# Altium project usbTosata_V1.1.PrjPCB
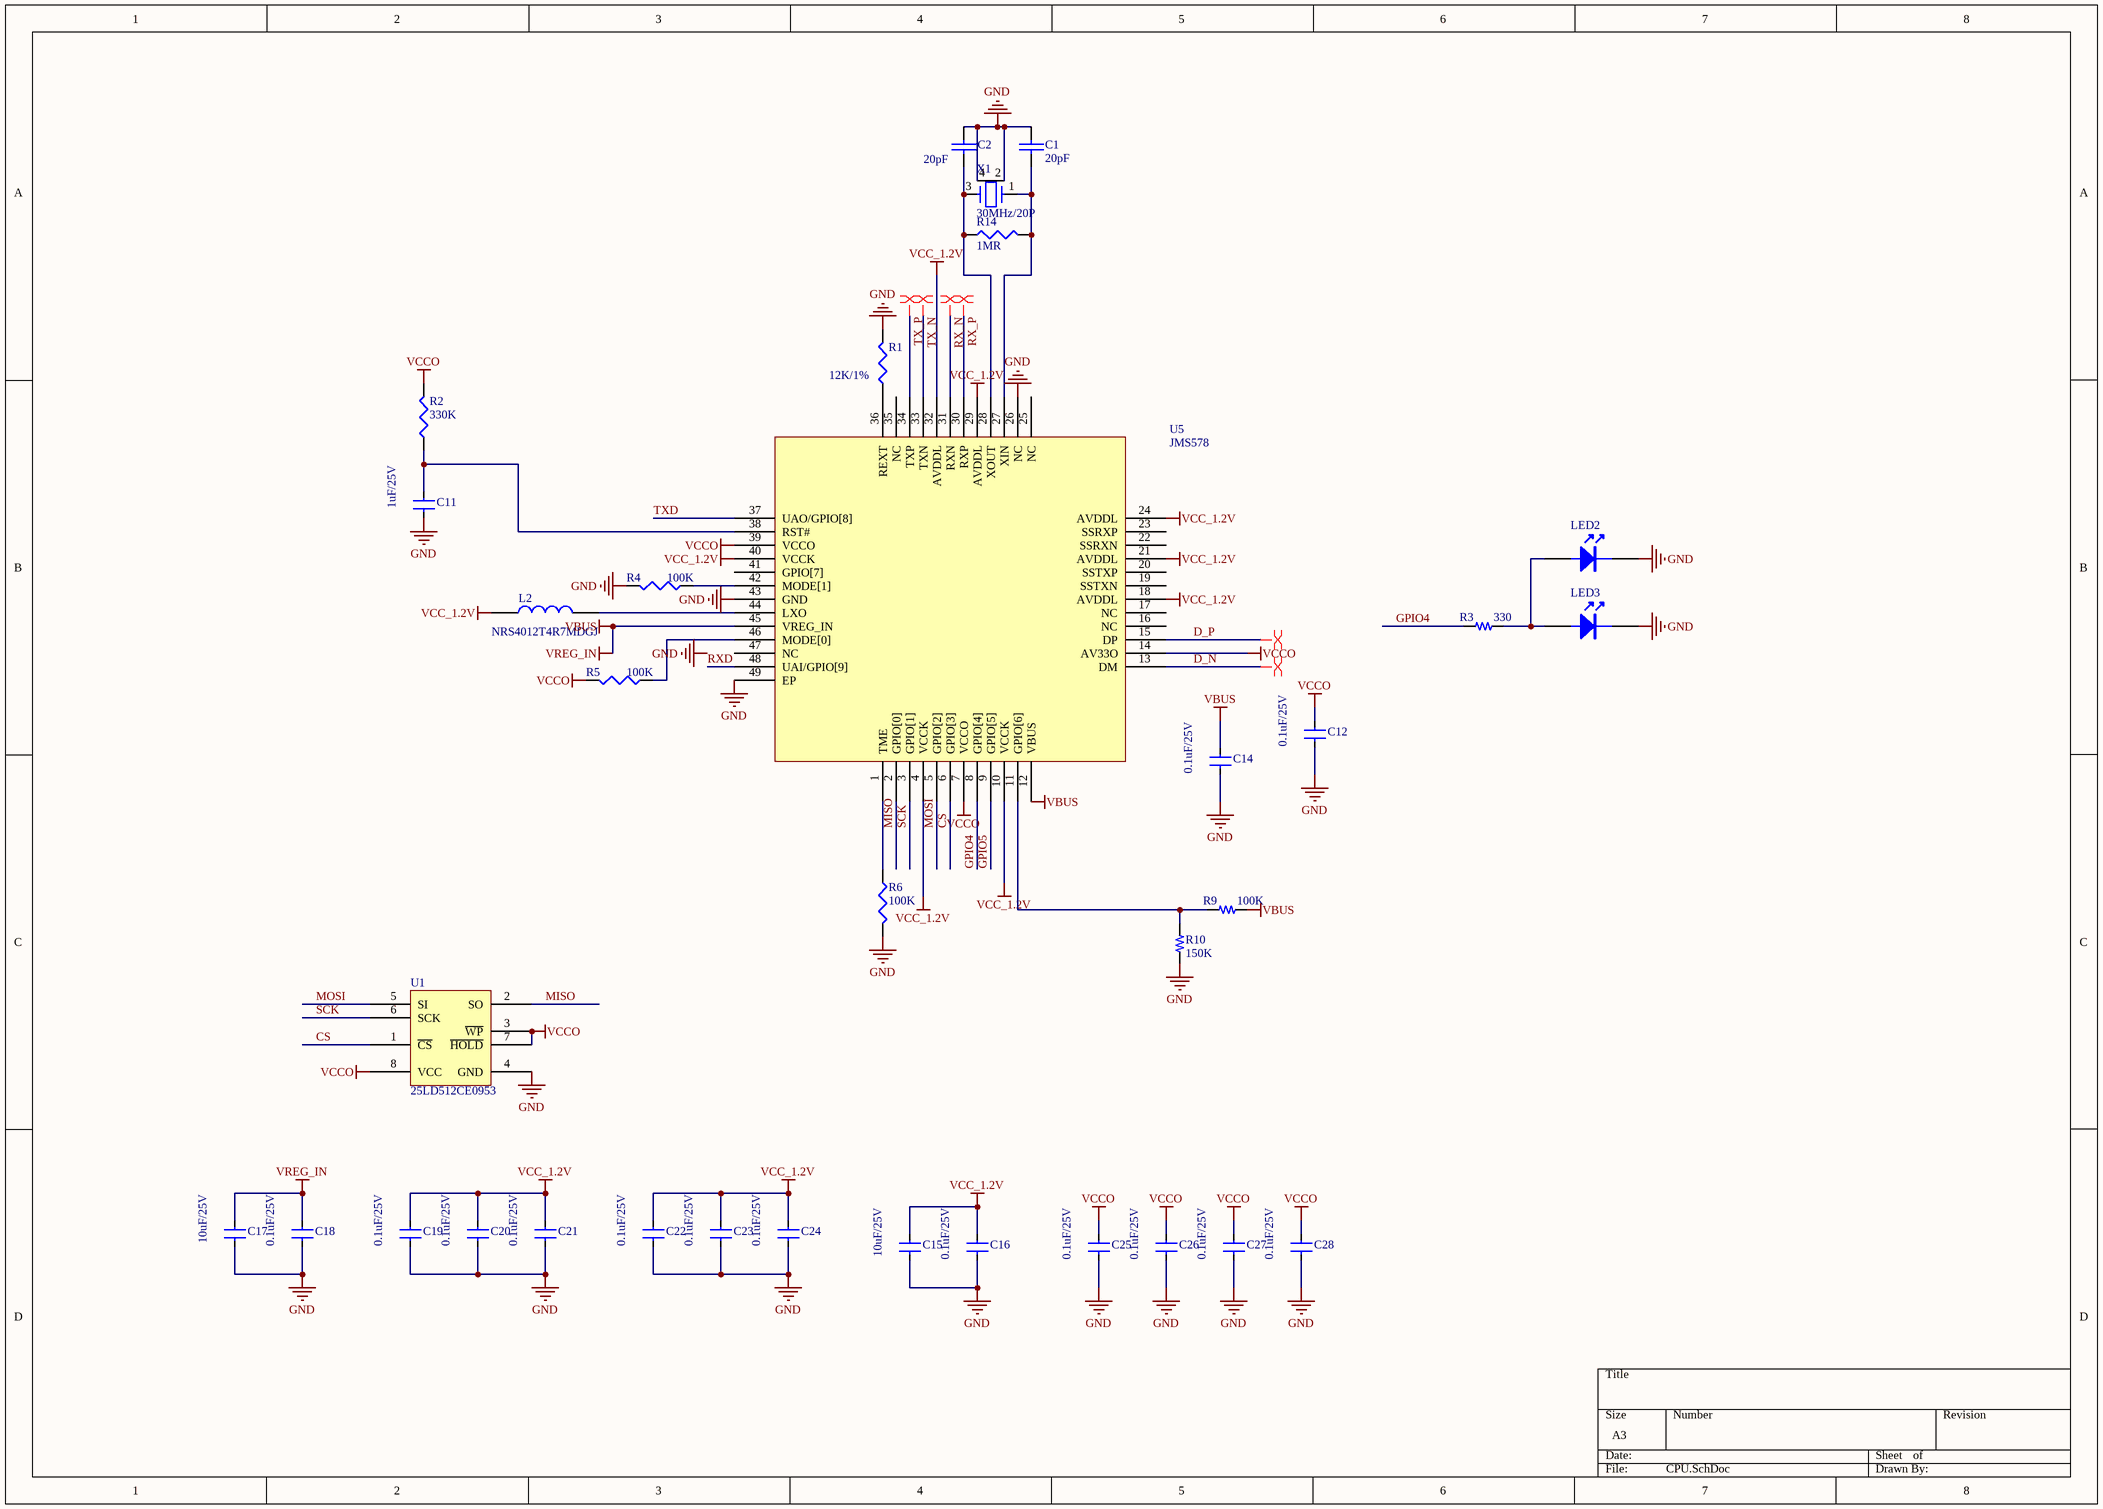
[diagram p0: CPU.SchDoc]
2 sheets, 49 parts. Net scope: global (net labels, ports and power ports of the same name join across sheets).
Board file: PCB1.PcbDoc
Sheets:
  CPU.SchDoc
  CONNECTOR.SchDoc

## Sheet CPU.SchDoc
size A3

### Parts
C1  20pF  [0603c]
C2  20pF  [0603C]
C11  1uF/25V  [0603C]
C12  0.1uF/25V  [0603C]
C14  0.1uF/25V  [0603C]
C15  10uF/25V  [0603C]
C16  0.1uF/25V  [0603C]
C17  10uF/25V  [0603C]
C18  0.1uF/25V  [0603C]
C19  0.1uF/25V  [0603C]
C20  0.1uF/25V  [0603C]
C21  0.1uF/25V  [0603C]
C22  0.1uF/25V  [0603C]
C23  0.1uF/25V  [0603C]
C24  0.1uF/25V  [0603C]
C25  0.1uF/25V  [0603C]
C26  0.1uF/25V  [0603C]
C27  0.1uF/25V  [0603C]
C28  0.1uF/25V  [0603C]
L2  NRS4012T4R7MDGJ  [NRS4012T4R7MDGJ]
LED2  (no value)  [0603LED]
LED3  (no value)  [0603LED]
R1  12K/1%  [0603R]
R2  330K  [0603R]
R3  330  [0603R]
R4  100K  [0603R]
R5  100K  [0603R]
R6  100K  [0603R]
R9  100K  [0603R]
R10  150K  [0603R]
R14  1MR  [0603R]
U1  25LD512CE0953  [SO-8]
U5  JMS578  [QFN400P600-8N]
X1  30MHz/20P  [XTAL4TN_3225]

### Nets
GND: C1.1 C2.1 C11.2 C12.2 C14.2 C15.2 C16.2 C17.2 C18.2 C19.2 C20.2 C21.2 C22.2 C23.2 C24.2 C25.2 C26.2 C27.2 C28.2 LED2.2 LED3.2 R1.2 R4.2 R6.2 R10.1 U1.4(GND) U5.26(NC) U5.43(GND) U5.49(EP) X1.2(GND) X1.4(GND)
VBUS: C14.1 C17.1 C18.1 R9.2 U5.12(VBUS) U5.45(VREG_IN)  [also labelled VREG_IN]
VCC_1.2V: C15.1 C16.1 C19.1 C20.1 C21.1 C22.1 C23.1 C24.1 L2.1 U5.4(VCCK) U5.10(VCCK) U5.18(AVDDL) U5.21(AVDDL) U5.24(AVDDL) U5.29(AVDDL) U5.32(AVDDL) U5.40(VCCK)
VCCO: C12.1 C25.1 C26.1 C27.1 C28.1 R2.2 R5.2 U1.3(~{WP}) U1.7(~{HOLD}) U1.8(VCC) U5.7(VCCO) U5.14(AV33O) U5.39(VCCO)
CS: U1.1(~{CS}) U5.6(GPIO[3])
D_N: U5.13(DM)
D_P: U5.15(DP)
GPIO4: R3.1 U5.8(GPIO[4])
GPIO5: U5.9(GPIO[5])
MISO: U1.2(SO) U5.2(GPIO[0])
MOSI: U1.5(SI) U5.5(GPIO[2])
RX_N: U5.31(RXN)
RX_P: U5.30(RXP)
RXD: U5.48(UAI/GPIO[9])
SCK: U1.6(SCK) U5.3(GPIO[1])
TX_N: U5.33(TXN)
TX_P: U5.34(TXP)
TXD: U5.37(UAO/GPIO[8])
NetC1_2: C1.2 R14.2 U5.27(XIN) X1.1(X1)
NetC2_2: C2.2 R14.1 U5.28(XOUT) X1.3(X2)
NetC11_1: C11.1 R2.1 U5.38(RST#)
NetL2_2: L2.2 U5.44(LXO)
NetLED2_1: LED2.1 LED3.1 R3.2
NetR1_1: R1.1 U5.36(REXT)
NetR4_1: R4.1 U5.42(MODE[1])
NetR5_1: R5.1 U5.46(MODE[0])
NetR6_1: R6.1 U5.1(TME)
NetR9_1: R9.1 R10.2 U5.11(GPIO[6])

Not connected (* = marked no-connect by the designer): U5 16(NC) 17(NC) 19(SSTXN) 20(SSTXP) 22(SSRXN) 23(SSRXP) 25(NC) 35(NC) 41(GPIO[7]) 47(NC)

### Layout directives
differential pair: D_N, D_P, RX_N, RX_P, TX_N, TX_P

### Notes on the sheet
- Labels drawn without touching a wire or pin: GND

### Library data of the parts
C1 C2 = CAP: Capacitor
C11 C12 C14-C28 = 0.01UF: CCX85-103
L2 = INDUCTOR
LED2 LED3 = LED
R1 R2 R4-R6 R14 = Res3: Resistor; Published: 8-Jun-2000; LatestRevisionDate: 29-May-2009; LatestRevisionNote: IPC-7351 Footprint Added.; PackageReference: J1-0603; Publisher: Altium Limited; PackageDescription: Chip Resistor
R3 R9 R10 = R
U1 = M25P40-VMN6
X1 = CRYSTAL_2

## Sheet CONNECTOR.SchDoc
size A4
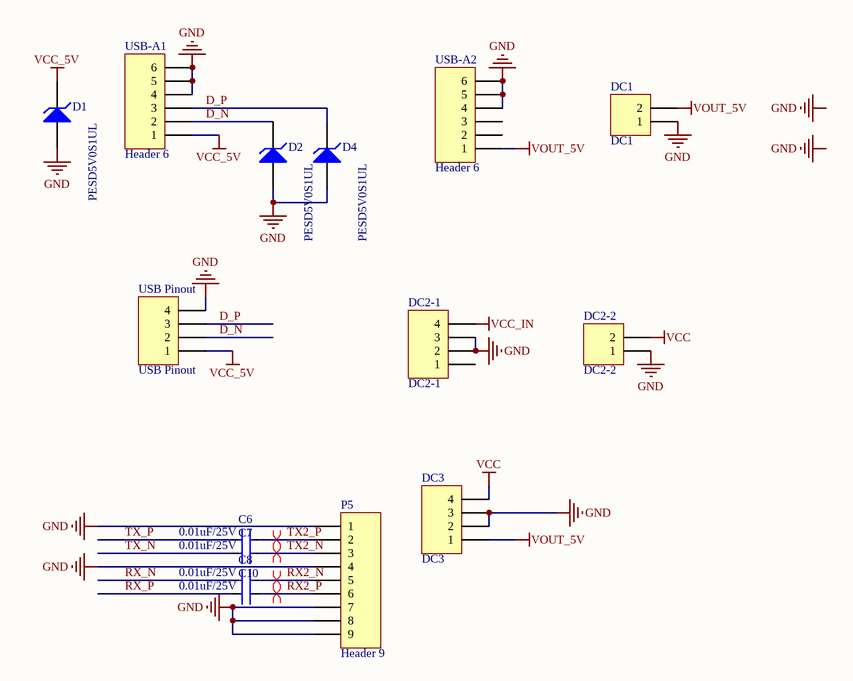
[diagram p1: CONNECTOR.SchDoc]

### Parts
C6  0.01uF/25V  [0603C]
C7  0.01uF/25V  [0603C]
C8  0.01uF/25V  [0603C]
C10  0.01uF/25V  [0603C]
D1  PESD5V0S1UL  [0402R]
D2  PESD5V0S1UL  [0402R]
D4  PESD5V0S1UL  [0402R]
DC1  DC1  [2X2MMZ]
DC2-1  DC2-1  [DC005]
DC2-2  DC2-2  [2X2MMZ]
DC3  DC3  [2X4MMZ]
P5  Header 9  [SATA 7P]
USB-A1  Header 6  [USB-A-C]
USB-A2  Header 6  [USB-A-C]
USB_Pinout  USB Pinout  [sip-4l]

### Nets
GND: D1.1(A) D2.1(A) D4.1(A) DC1.1 DC2-1.2 DC2-1.3 DC2-2.1 DC3.2 DC3.3 P5.1 P5.4 P5.7 P5.8 P5.9 USB-A1.4 USB-A1.5 USB-A1.6 USB-A2.4 USB-A2.5 USB-A2.6 USB_Pinout.4
VCC: DC2-2.2 DC3.4
VCC_5V: D1.2(K) USB-A1.1 USB_Pinout.1
VCC_IN: DC2-1.4
VOUT_5V: DC1.2 DC3.1 USB-A2.1
D_N: D2.2(K) USB-A1.2 USB_Pinout.2
D_P: D4.2(K) USB-A1.3 USB_Pinout.3
RX2_N: C8.2 P5.5
RX2_P: C10.2 P5.6
RX_N: C8.1
RX_P: C10.1
TX2_N: C7.2 P5.3
TX2_P: C6.2 P5.2
TX_N: C7.1
TX_P: C6.1

Not connected (* = marked no-connect by the designer): DC2-1 1; USB-A2 2 3

### Layout directives
differential pair: RX2_N, RX2_P, TX2_N, TX2_P

### Notes on the sheet
- Labels drawn without touching a wire or pin: GND

### Library data of the parts
C6-C8 C10 = 0.01UF: CCX85-103
D1 D2 D4 = D Zener: Zener Diode; Published: 8-Jun-2000; LatestRevisionDate: 17-Jul-2002; LatestRevisionNote: Re-released for DXP Platform.; PackageReference: DIODE-0.7; Publisher: Altium Limited
DC1 DC2-2 = Header 2: Header, 2-Pin; LatestRevisionDate: 17-Jul-2002; LatestRevisionNote: Re-released for DXP Platform.; Publisher: Altium Limited
DC2-1 DC3 USB_Pinout = Header 4: Header, 4-Pin; LatestRevisionDate: 17-Jul-2002; LatestRevisionNote: Re-released for DXP Platform.; Publisher: Altium Limited
P5 = Header 9: Header, 9-Pin; LatestRevisionDate: 17-Jul-2002; LatestRevisionNote: Re-released for DXP Platform.; Publisher: Altium Limited
USB-A1 USB-A2 = Header 6: Header, 6-Pin; LatestRevisionDate: 17-Jul-2002; LatestRevisionNote: Re-released for DXP Platform.; Publisher: Altium Limited

## Nets that join several sheets
GND: CPU (31 pins), CONNECTOR (21 pins)
D_N: CPU (U5.13), CONNECTOR (D2.2 USB-A1.2 USB_Pinout.2)
D_P: CPU (U5.15), CONNECTOR (D4.2 USB-A1.3 USB_Pinout.3)
RX_N: CPU (U5.31), CONNECTOR (C8.1)
RX_P: CPU (U5.30), CONNECTOR (C10.1)
TX_N: CPU (U5.33), CONNECTOR (C7.1)
TX_P: CPU (U5.34), CONNECTOR (C6.1)